# Altium schematic sheet SolBoutin.SchDoc
size A4; SheetNumber: 3; SheetTotal: 5
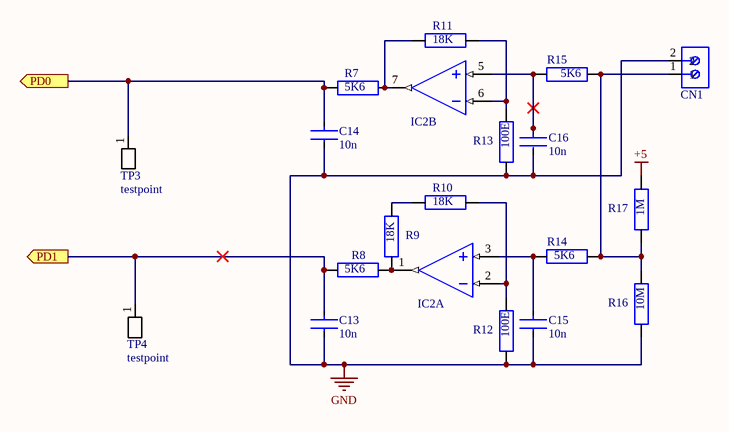
[diagram p0: SolBoutin.SchDoc]

## Parts
C13  10n  [FP-C0805C-DN-IPC_A]
C14  10n  [FP-C0805C-DN-IPC_A]
C15  10n  [FP-C0805C-DN-IPC_A]
C16  10n  [FP-C0805C-DN-IPC_A]
CN1  282836-2  [cnn2pin]  (value not drawn)
IC2  MCP6002-E/P  [DIP8PIN]  (value not drawn)  (parts A,B of 3)
R7  5K6  [res0805ph]
R8  5K6  [res0805ph]
R9  18K  [res0805ph]
R10  18K  [res0805ph]
R11  18K  [res0805ph]
R12  100E  [res0805ph]
R13  100E  [res0805ph]
R14  5K6  [res0805ph]
R15  5K6  [res0805ph]
R16  10M  [res0805ph]
R17  1M  [res0805ph]
TP3  testpoint  [testpin]
TP4  testpoint  [testpin]

## Ports
PD0 (out), PD1 (out)

## Nets
+5: R17.2
GND: C13.2 C14.2 C15.2 C16.2 CN1.2 R12.1 R13.1 R16.1
PD0: C14.1 R7.2 TP3.1(TP) ; port PD0
PD1: C13.1 R8.2 TP4.1(TP) ; port PD1
NetC15_1: C15.1 IC2.3(VINA+) R14.2
NetC16_1: C16.1 IC2.5(VINB+) R15.2
NetCN1_1: CN1.1 R14.1 R15.1 R16.2 R17.1
NetIC2_1: IC2.1(VOUTA) R8.1 R9.1
NetIC2_2: IC2.2(VINA-) R10.1 R12.2
NetIC2_6: IC2.6(VINB-) R11.1 R13.2
NetIC2_7: IC2.7(VOUTB) R7.1 R11.2
NetR9_2: R9.2 R10.2

## Library data of the parts
C13-C16 = CMP-2007-00259-2: CAP CER 10000PF 200V X7R 0805; Manufacturer Part Number: C0805C103K2RACTU; Manufacturer: KEMET; Material: Ceramic; Temperature Coefficient: 30ppm/°C; Capacitance: 10,000 pF; Tolerance: 0.1; Value: 10,000 pF; Device Class L2: Capacitors; Voltage Rating: 200 V; Temperature Range High: +125°C; ComponentLink2Description: Datasheet; Height: 0.88mm; Octopart: https://octopart.com/c0805c103k2ractu-kemet-9138347; ComponentLink2URL: https://content.kemet.com/datasheets/KEM_C1003_C0G_SMD.pdf; Category: Cap; Temperature: -55°C to +125°C; Temperature Range Low: -55°C; Digikey Description: CAP CER 10000PF 200V X7R 0805; Temperature Characteristic: X7R; Automotive: No; Device Class L3: Ceramic Capacitors; Mouser Description: KEMET - C0805C103K2RACTU - CAP, MLCC, X7R, 10NF, 200V, 0805; RoHS: TRUE; Device Class L1: Passive Components; Lead Free: Yes; Package: C0805C-DN; Ipc Land Pattern Name: CAPC200125X78
CN1 = CNN2P: Female Header, Pitch 5 mm, 1 x 2 Position, Height 10 mm, Tail Length 3.5 mm, Rohs, Bulk; Manufacturer: TE Connectivity; Wire Gauge: 16-30AWG; Product Training Modules: Wire-to-BoardEurostyleTerminalBlocks; Clamp Material - Plating: Brass-NickelPlated; Voltage: 300V; Mating Orientation: HorizontalwithBoard; Current: 13.5A; Pitch: 0.197"(5.00mm); Screw Thread: M3; 3D Model: 282836-2.pdf; Other Names: 5ULV-02B / A98076; Dynamic Catalog: BuchananSeries; Number of Levels: 1; Torque - Screw: 0.68Nm(6Lb-In); Featured Product: EurostyleTerminalBlockConnectors; Positions Per Level: 2; Wire Termination: Screw-RisingCageClamp; Datasheet URL: http://www.te.com.cn/commerce/DocumentDelivery/DDEController?Action=showdoc&DocId=Catalog+Section%7F1308389_EUROSTYLE_TERMINAL_BLOCKS%7F0607%7Fpdf%7FEnglish%7FENG_CS_1308389_EUROSTYLE_TERMINAL_BLOCKS_0607.pdf%7F282836-2; Color: Green; Family: TerminalBlocks-WiretoBoard; RoHS Information: 282836-2StatementofCompliance; Standard Package: 300; Contact Material - Plating: Brass-TinPlated; Manufacturer URL: http://www.te.com; Housing Material: Polyamide(PA66),Nylon6/6; Features: Interlocking(Side); Package Description: Female Header, Pitch 5 mm, 1 x 2 Position, Height 10 mm, Tail Length 3.5 mm; Mounting Type: ThroughHole; Package Reference: THD; Packaging: Bulk; Series: Buchanan; Category: Connectors,Interconnects; Screw Material - Plating: Brass-NickelPlated
IC2 = AMP-OPA-MCP6002-IL8: None; Slew Rate: 0.6V/µs; Supply Current: 100uA; Power Supply Rejection Ratio (PSRR): 86dB; Input Offset Voltage (Vos): 4.5mV; Input Bias Current: 1pA; Amplifier Type: GENERAL PURPOSE; Unity Gain Bandwidth Product: 1MHz; Number of Circuits: 2; Output Current: 23mA; Operating Supply Voltage: 5.5V; Min Supply Voltage: 1.8V; Common Mode Rejection Ratio: 60dB; Voltage Gain: 112dB; Max Supply Voltage: 6V; Package Quantity: 60; REACH SVHC: No SVHC; Min Operating Temperature: -40°C; Max Operating Temperature: 125°C; Mount: Through Hole; Nominal Supply Current: 100uA; Height: 3.3mm; Length: 9.27mm; Slew Rate-Nom: 0.6V/µs; Packaging: Rail/Tube; Output Current per Channel: 23mA; Number of Amplifiers: 2; RoHS Compliant: Yes; Radiation Hardening: No; Bandwidth: 1MHz; Lead Free: Lead Free; Width: 6.35mm; Number of Channels: 2; Gain Bandwidth Product: 1MHz; Technology: CMOS; Operating Supply Current: 100uA; Number of Elements: 2; Number of Pins: 8; Input Offset Voltage-Max: 4.5mV; Case/Package: PDIP
R7-R17 = Res: Resistor; Manufacturer_Name: TE Connectivity; Manufacturer_Part_Number: CPF0201D10K2C1; Datasheet Link: http://www.te.com/commerce/DocumentDelivery/DDEController?Action=showdoc&DocId=Data+Sheet%7F1773200-1%7FA%7Fpdf%7FEnglish%7FENG_DS_1773200-1_A.pdf%7F4-2176215-6; Height: 0.28mm; Mouser Part Number: N/A; Mouser Price/Stock: https://www.mouser.com/Search/Refine.aspx?Keyword=N%2FA